# Altium schematic sheet Halfbridges.SchDoc
size A4; CompanyName: Technische Hochschule Nürnberg Georg Simon Ohm; Organization: UltraZohm; Address1: Kesslerplatz 12; Address2: 90489 Nürnberg; Address3: GERMANY; SheetNumber: 5; SheetTotal: 9; Website: www.ultrazohm.com
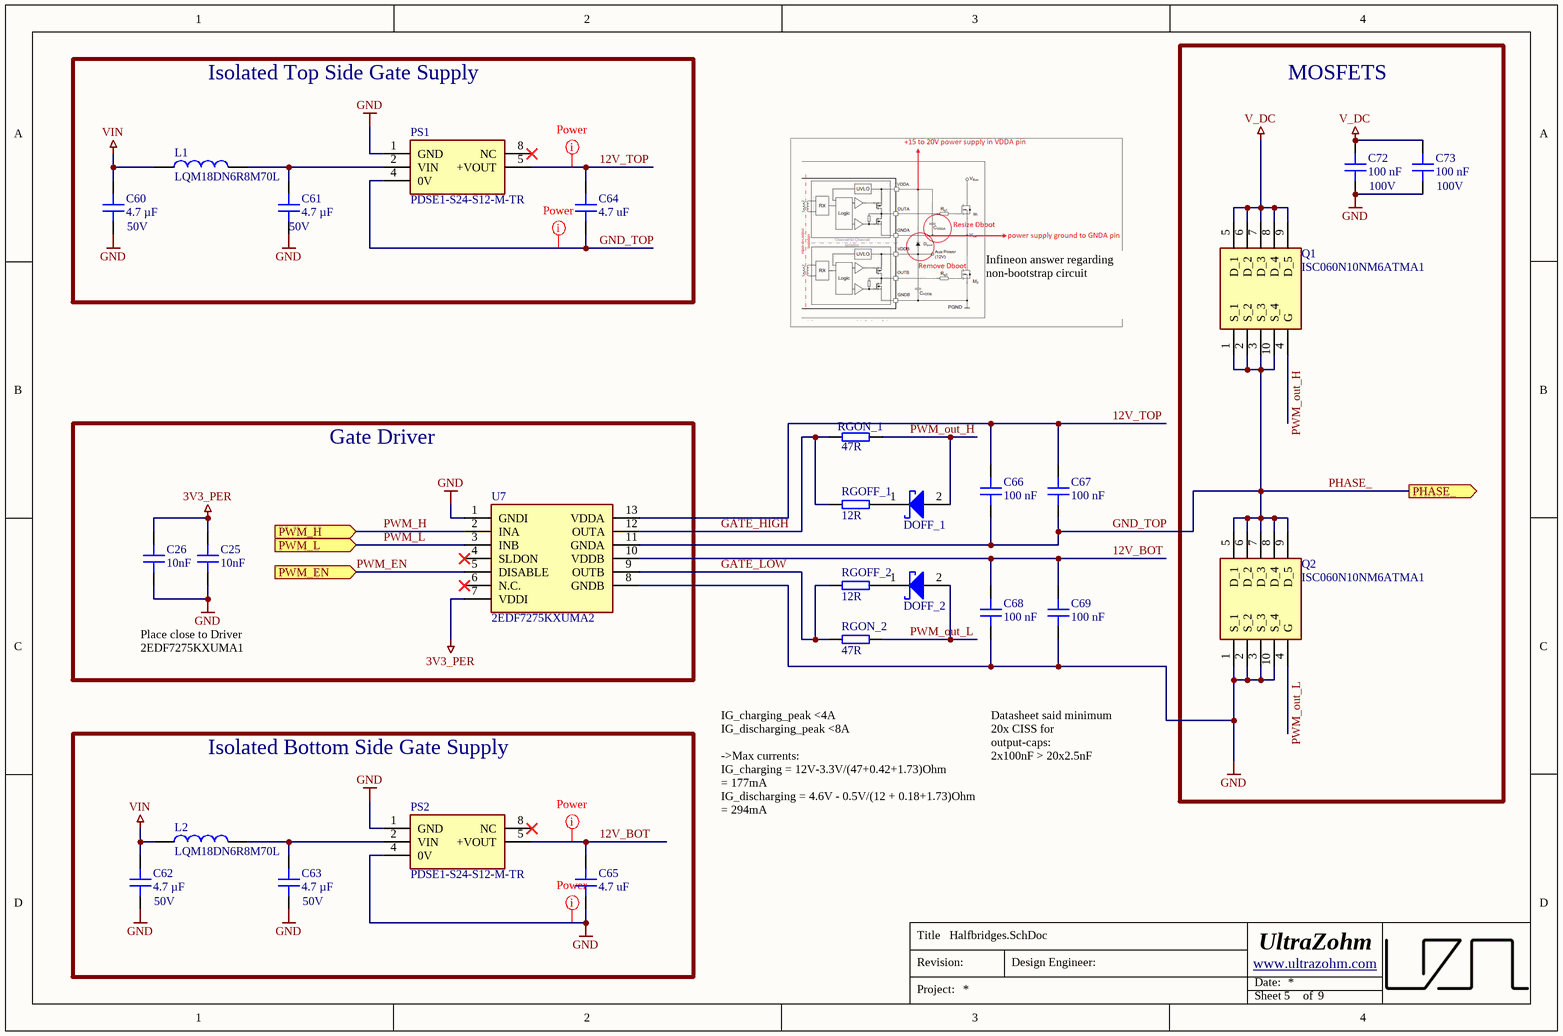
[diagram p0: Halfbridges.SchDoc]

## Parts
C25  10nF  [C_0603]
C26  10nF  [C_0603]
C60  4.7 µF  [C_0805]
C61  4.7 µF  [C_0805]
C62  4.7 µF  [C_0805]
C63  4.7 µF  [C_0805]
C64  4.7 uF  [C_0603]
C65  4.7 uF  [C_0603]
C66  100 nF  [C_0603]
C67  100 nF  [C_0603]
C68  100 nF  [C_0603]
C69  100 nF  [C_0603]
C72  100 nF  [C_0603]
C73  100 nF  [C_0603]
DOFF_1  BAT165E6327  [SOD2513X110N]  (value not drawn)
DOFF_2  BAT165E6327  [SOD2513X110N]  (value not drawn)
L1  LQM18DN6R8M70L  [INDC1608X95N]
L2  LQM18DN6R8M70L  [INDC1608X95N]
PS1  PDSE1-S24-S12-M-TR  [PDSE1S24S12MTR]
PS2  PDSE1-S24-S12-M-TR  [PDSE1S24S12MTR]
Q1  ISC060N10NM6ATMA1  [ISC060N10NM6ATMA1]
Q2  ISC060N10NM6ATMA1  [ISC060N10NM6ATMA1]
RGOFF_1  12R  [RESC1609X55N]
RGOFF_2  12R  [RESC1609X55N]
RGON_1  47R  [RESC1609X55N]
RGON_2  47R  [RESC1609X55N]
U7  2EDF7275KXUMA2  [2EDF7275KXUMA1]

## Blocks framed on the sheet
Isolated Top Side Gate Supply: C60 C61 C64 L1 PS1
MOSFETS: C72 C73 Q1 Q2
Gate Driver: C25 C26 U7
Isolated Bottom Side Gate Supply: C62 C63 C65 L2 PS2

## Ports
PHASE_ (out), PWM_EN (in), PWM_H (in), PWM_L (in)

## Nets
3V3_PER: C25.2 C26.2 U7.7(VDDI)
GND: C25.1 C26.1 C60.2 C61.2 C62.2 C63.2 C65.1 C68.1 C69.1 C72.1 C73.1 PS1.1(GND) PS2.1(GND) PS2.4(0V) Q2.1(S_1) Q2.2(S_2) Q2.3(S_3) Q2.10(S_4) U7.1(GNDI) U7.8(GNDB)
V_DC: C72.2 C73.2 Q1.5(D_1) Q1.6(D_2) Q1.7(D_3) Q1.8(D_4) Q1.9(D_5)
VIN: C60.1 C62.1 L1.1 L2.1
12V_BOT: C65.2 C68.2 C69.2 PS2.5(+VOUT) U7.10(VDDB)
12V_TOP: C64.2 C66.2 C67.2 PS1.5(+VOUT) U7.13(VDDA)
GATE_HIGH: RGOFF_1.1 RGON_1.1 U7.12(OUTA)
GATE_LOW: RGOFF_2.1 RGON_2.1 U7.9(OUTB)
GND_TOP: C64.1 C66.1 C67.1 PS1.4(0V) Q1.1(S_1) Q1.2(S_2) Q1.3(S_3) Q1.10(S_4) Q2.5(D_1) Q2.6(D_2) Q2.7(D_3) Q2.8(D_4) Q2.9(D_5) U7.11(GNDA) ; port PHASE_  [also labelled PHASE_]
PWM_EN: U7.5(DISABLE) ; port PWM_EN
PWM_H: U7.2(INA) ; port PWM_H
PWM_L: U7.3(INB) ; port PWM_L
PWM_out_H: DOFF_1.2(A) Q1.4(G) RGON_1.2
PWM_out_L: DOFF_2.2(A) Q2.4(G) RGON_2.2
NetC61_1: C61.1 L1.2 PS1.2(VIN)
NetC63_1: C63.1 L2.2 PS2.2(VIN)
NetDOFF_1_1: DOFF_1.1(K) RGOFF_1.2
NetDOFF_2_1: DOFF_2.1(K) RGOFF_2.2

Not connected (* = marked no-connect by the designer): PS1 8(NC)*; PS2 8(NC)*; U7 4(SLDON)* 6(N.C.)*

## Layout directives
net class Power: 12V_BOT, 12V_TOP, GND, GND_TOP

## Notes on the sheet
- (near C60) 50V
- (near C61) 50V
- (near C72) 100V
- (near C73) 100V
- Infineon answer regarding non-bootstrap circuit
- Place close to Driver
  2EDF7275KXUMA1
- Datasheet said minimum 20x CISS for output-caps:
  2x100nF > 20x2.5nF
- IG_charging_peak <4A
  IG_discharging_peak <8A
  ->Max currents:
  IG_charging = 12V-3.3V/(47+0.42+1.73)Ohm
  = 177mA
  IG_discharging = 4.6V - 0.5V/(12 + 0.18+1.73)Ohm = 294mA
- (near C62) 50V
- (near C63) 50V
- Title
- Revision:
- Design Engineer:
- Date:
- Project:
- Sheet
- of

## Library data of the parts
C25 C26 = CT41G-0603-2X1-50V-0.01μF-K(N): 50V 10nF 2X1 ±10%; Manufacturer: TORCH; Voltage Rating: 50 VDC; Created from: KIlhan; Manufacturer Part Number: CT41G-0603-2X1-50V-0.01μF-K(N); PartID: 130; Created On: 05.07.2023 18:57:50; ComponentLink1Description: Datasheet; ComponentLink1URL: https://datasheet.lcsc.com/lcsc/1809291621_TORCH-CT41G-0603-2X1-50V-0-01-F-K-N_C136131.pdf; Component Type: Capacitor 0603; Device Package: 0603; Last Updated: 05.07.2023 18:57:50; Mounting Type: SMD; Operating Temperature: -55 - 125°C; Supplier 1: LCSC; Supplier Part Number 1: C136131; Type: Capacitor; Tolerance: 10 %; Value: 10nF; Live Cycle Status: 1; Stock number: not stored; LCSC Part Number: C136131
C60-C63 = C2012X7R1H475K125AC: Capacitor 0805, 50 VDC, 4.7 µF, X7R; Manufacturer: TDK; Tolerance: 10 %; Voltage Rating: 50 VDC; Created from: MGremer; Manufacturer Part Number: C2012X7R1H475K125AC; PartID: 15; Created On: 20.12.2020 13:54:13; ComponentLink1Description: Datasheet; ComponentLink1URL: https://product.tdk.com/info/en/catalog/datasheets/mlcc_commercial_general_en.pdf; Component Type: Capacitor 0805; Device Package: 0805; Last Updated: 21.02.2024 14:33:48; Mounting Type: SMD; Operating Temperature: -55 - 125°C; Series: C; Supplier 1: Mouser; Supplier Part Number 1: 810-C2012X7R475K125C; Type: Capacitor; Value: 4.7 µF; Live Cycle Status: 1; Stock number: Labor SMD Container; Supplier 2: LCSC; Supplier Part Number 2: C437557; LCSC Part Number: C437557
C64 C65 = C1608JB1V475M080AC: Multilayer Ceramic Capacitors MLCC - SMD/SMT RECOMMENDED ALT 810-C1608X5R1V475K; Manufacturer: TDK; Tolerance: 20 %; Voltage Rating: 35 VDC; Created from: KPatel; Manufacturer Part Number: C1608JB1V475M080AC; PartID: 159; Created On: 12/20/2020 1:54:13 PM; ComponentLink1Description: Datasheet; ComponentLink1URL: https://product.tdk.com/system/files/dam/doc/product/capacitor/ceramic/mlcc/catalog/mlcc_commercial_general_en.pdf; Component Type: Capacitor 0603; Device Package: 0603; Last Updated: 12/14/2022 12:14:21 PM; Mounting Type: SMD; Operating Temperature: -55 to 125°C; Series: X7R; Supplier 1: LCSC; Supplier Part Number 1: C3858973; Type: Capacitor; Value: 4.7 uF; Live Cycle Status: 1; LCSC Part Number: C3858973; Stock number: not stored
C66-C69 C72 C73 = C1608X7S2A104KT000N: 100V 100nF X7S ±10% 0603 Multilayer Ceramic Capacitors MLCC - SMD/SMT ROHS; Manufacturer: TDK; Voltage Rating: 100 VDC; Created from: AGeiger; Manufacturer Part Number: C1608X7S2A104KT000N; PartID: 148; Created On: 20.12.2020 13:54:13; ComponentLink1Description: Datasheet; ComponentLink1URL: https://datasheet.lcsc.com/lcsc/2304140030_TDK-C1608X7S2A104KT000N_C343025.pdf; Component Type: Capacitor 0603; Device Package: 0603; Last Updated: 14.12.2022 12:14:21; Mounting Type: SMD; Operating Temperature: -55 to 125°C; Series: X7R; Supplier 1: LCSC; Supplier Part Number 1: C343025; Type: Capacitor; Tolerance: 10 %; Value: 100 nF; Live Cycle Status: 1; Stock number: not stored; LCSC Part Number: C343025
DOFF_1 DOFF_2 = BAT165E6327: Schottky Diode, 40 V, 750mA; Manufacturer: Infineon Technologies; Forward Current: 0.75 A; Forward Voltage: 40V; Reverse Current: 50uA; Value: 40V; Created from: Kpatel; Manufacturer Part Number: BAT165E6327; PartID: 19; Created On: 6/11/2024 12:14:10 PM; ComponentLink1Description: Datasheet; ComponentLink1URL: https://www.mouser.de/datasheet/2/196/bat165series-12207.pdf; Component Type: Schottky Diode; Device Package: SOD-323-2; Last Updated: 7/30/2024 11:32:39 AM; Mounting Type: SMD; Operating Temperature: -65 - 150 °C; Series: BAT165; Supplier 1: Mouser; Supplier Part Number 1: 726-BAT165E6327; Supplier 2: JLC; Supplier Part Number 2: C533629; Type: Schottky Diode; Live Cycle Status: 1; Stock number: not stored
L1 L2 = LQM18DN6R8M70L: 6.8µH, 120mA, 0603, 740mOhm, 20%; Manufacturer: Murata; MF: EPCOS / TDK; Value: 6.8uH; DCR: 320m; Rated Current: 0.85 A; Type: fixed inductor; Created from: DHufnagel; MPN: B82464G4154M; Supplier 1: Mouser; Supplier Part Number 1: 81-LQM18DN6R8M70L; Manufacturer Part Number: LQM18DN6R8M70L; PartID: 10; Created On: 19.07.2022 15:47:17; ComponentLink1Description: Datasheet; ComponentLink1URL: https://www.mouser.de/datasheet/2/281/1/JELF243B_0086-2298241.pdf; Component Type: SMD fixed inductor; Device Package: SMD; Last Updated: 15.06.2023 16:03:16; Mounting Type: SMD; Operating Temperature: -40 - 125°C; Series: LQM18DN_70; Supplier 2: Digi-Key; Supplier Part Number 2: 490-LQM18DN6R8M70LCT-ND; DC current: 120mA; Live Cycle Status: 1; Stock number: not stored; LCSC Part Number: C1881372
PS1 PS2 = PDSE1-S24-S12-M-TR: Isolated, 21.6 -26.4Vin, 12V out, 1W, 84mA out; Manufacturer: CUI Inc.; Created from: DHufnagel; Manufacturer Part Number: PDSE1-S24-S12-M-TR; PartID: 21; Created On: 19.07.2022 14:22:00; ComponentLink1Description: Datasheet; ComponentLink1URL: https://www.mouser.de/datasheet/2/670/pdse1_m-1596038.pdf; Component Type: Isolated DC-DC Converter; Device Package: SMT-5; Last Updated: 05.07.2023 17:07:31; Mounting Type: SMT; Operating Temperature: -40 - 105°C; Series: PDSE1-M; Supplier 1: Mouser; Supplier Part Number 1: 490-PDSE1-S24-S12MTR; Supplier 2: Digi-Key; Supplier Part Number 2: 102-PDSE1-S24-S12-M-TRCT-ND; Type: isolated DC-DC Converter; Value: 1 W; Live Cycle Status: 1; Stock number: not stored; LCSC Part Number: C6730719
Q1 Q2 = ISC060N10NM6ATMA1: Power MOSFET, n-Channel, 97A, 100V; Manufacturer: Infineon Technologies; Value: 100V, 97A; Created from: DHufnagel; Manufacturer Part Number: ISC060N10NM6ATMA1; PartID: 3; Created On: 28.06.2022 07:55:49; ComponentLink1Description: Datasheet; ComponentLink1URL: https://www.mouser.de/datasheet/2/196/Infineon_ISC060N10NM6_DataSheet_v02_00_EN-2942434.pdf; Component Type: Power MOSFET; Device Package: PG-TDSON-8 FL; Last Updated: 21.02.2024 15:31:45; Mounting Type: SMD; Operating Temperature: -55 - 175°C; Series: ISC060N10; Supplier 1: Mouser; Supplier Part Number 1: 726-ISC060N10NM6ATMA; Supplier 2: RS-online; Supplier Part Number 2: 235-4869; Type: Power MOSFET; Live Cycle Status: 1; Stock number: not stored; Supplier 3: LCSC; Supplier Part Number 3: C3288847; LCSC Part Number: C3288847
RGOFF_1 RGOFF_2 = RT0603WRC0712RL: SMD resistor E24 series; Manufacturer: YAGEO; Tolerance: 0.05%; Created from: K.Patel; Manufacturer Part Number: RT0603WRC0712RL; PartID: 349; Created On: 8/14/2024 5:03:13 PM; ComponentLink1Description: Datasheet; ComponentLink1URL: https://wmsc.lcsc.com/wmsc/upload/file/pdf/v2/lcsc/2403111543_YAGEO-RT0603WRC0712RL_C1720876.pdf; Component Type: SMD resistor; Device Package: 0603; Last Updated: 8/14/2024 5:03:13 PM; Mounting Type: SMD; Supplier 1: Mouser; Supplier Part Number 1: C1720876; Supplier 2: LCSC; Supplier Part Number 2: C1720876; Type: Resistor; Value: 12R; Live Cycle Status: 1; LCSC Part Number: C1720876
RGON_1 RGON_2 = RT0603WRC0747RL: SMD resistor E24 series; Manufacturer: YAGEO; Tolerance: 0.05%; Created from: K.Patel; Manufacturer Part Number: RT0603WRC0747RL; PartID: 350; Created On: 8/14/2024 5:03:13 PM; ComponentLink1Description: Datasheet; ComponentLink1URL: https://wmsc.lcsc.com/wmsc/upload/file/pdf/v2/lcsc/2403111541_YAGEO-RT0603WRC0747RL_C1718809.pdf; Component Type: SMD resistor; Device Package: 0603; Last Updated: 8/14/2024 5:03:13 PM; Mounting Type: SMD; Supplier 1: Mouser; Supplier Part Number 1: C1718809; Supplier 2: LCSC; Supplier Part Number 2: C1718809; Type: Resistor; Value: 47R; Live Cycle Status: 1; LCSC Part Number: C1718809
U7 = 2EDF7275KXUMA2: Gate Driver  8A, 1.5 kV, daul channel isolated gate driver; Manufacturer: Infineon Technologies; Created from: AGeiger; Manufacturer Part Number: 2EDF7275KXUMA2; PartID: 7; Created On: 21.02.2024 16:40:21; ComponentLink1Description: Datasheet; ComponentLink1URL: https://datasheet.lcsc.com/lcsc/2202151130_Infineon-Technologies-2EDF7275KXUMA2_C2975252.pdf; Component Type: Gate Driver; Device Package: PG-TFLGA-13-1; Last Updated: 21.02.2024 16:40:21; Mounting Type: SMD; Operating Temperature: -40 - 125°C; Supplier 1: LCSC; Supplier Part Number 1: C2975252; Type: Gate Driver; Live Cycle Status: 1; Stock number: not stored; LCSC Part Number: C2975252